# EAGLE design keyboard_project (EAGLE 7.1.0)
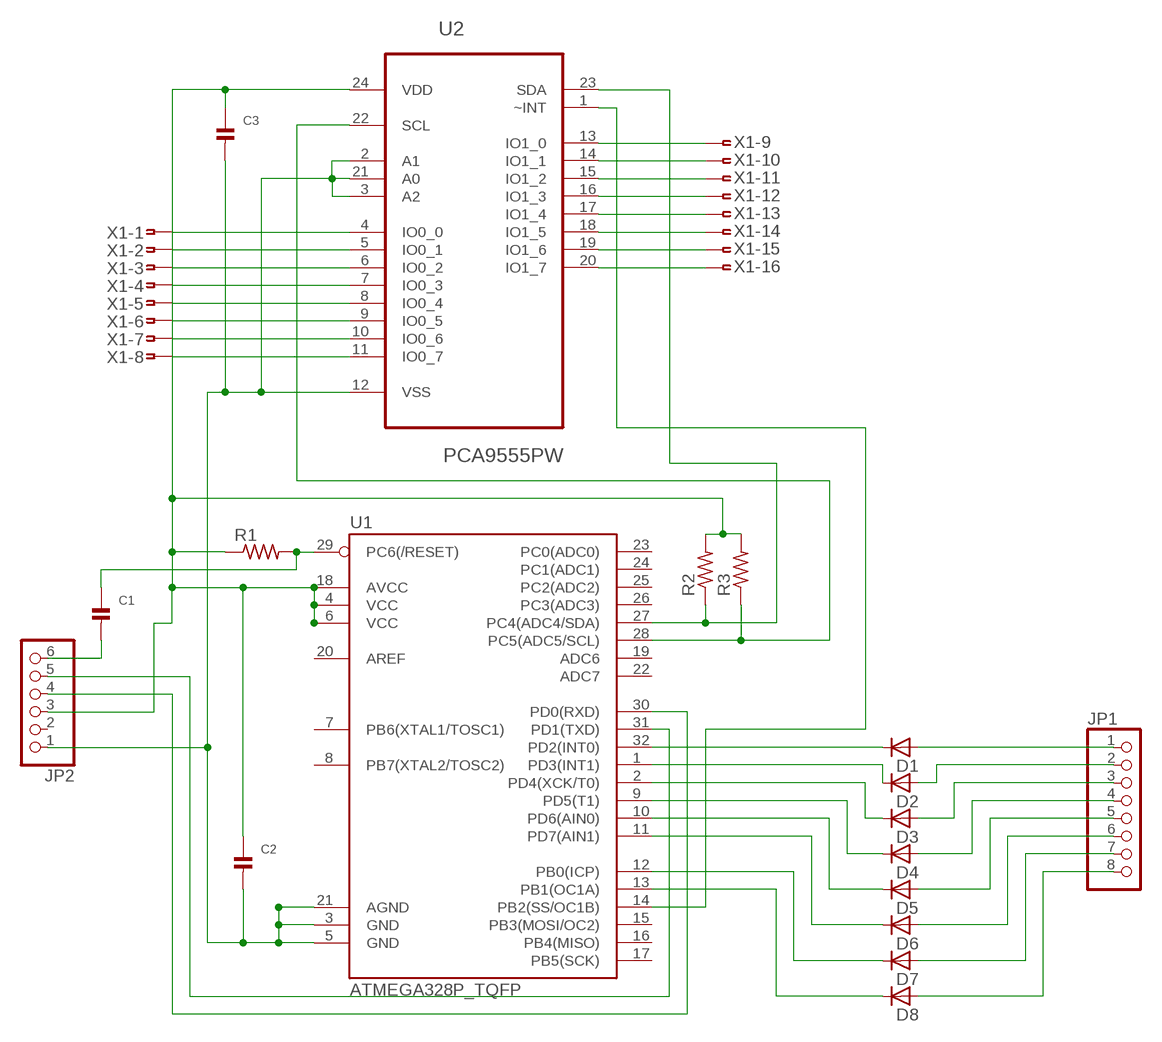
[diagram p0: schematic, sheet 1]

## Parts
C1  CAP_CERAMIC0603  [0603]
C2  CAP_CERAMIC0603  [0603]
C3  CAP_CERAMIC0603  [0603]
D1  D1N4148  [D45/2]
D2  D1N4148  [D45/2]
D3  D1N4148  [D45/2]
D4  D1N4148  [D45/2]
D5  D1N4148  [D45/2]
D6  D1N4148  [D45/2]
D7  D1N4148  [D45/2]
D8  D1N4148  [D45/2]
JP1  PINHD-1X8  [1X08]
JP2  HEADER-1X6  [1X06_OVAL]
R1  R-US_R0603  [R0603]
R2  R-US_R0603  [R0603]
R3  R-US_R0603  [R0603]
U1  ATMEGA328P_TQFP  [TQFP32-08]
U2  PCA9555PW  [SOP65P640X110-24N]
X1  FTOP-16  [FTOP-16]

## Nets
N$1: U2.4(IO0_0) X1.1
N$2: U2.5(IO0_1) X1.2
N$3: U2.6(IO0_2) X1.3
N$4: U2.7(IO0_3) X1.4
N$5: U2.8(IO0_4) X1.5
N$6: U2.9(IO0_5) X1.6
N$7: U2.10(IO0_6) X1.7
N$8: U2.11(IO0_7) X1.8
N$9: U2.13(IO1_0) X1.9
N$10: U2.14(IO1_1) X1.10
N$11: U2.15(IO1_2) X1.11
N$12: U2.16(IO1_3) X1.12
N$13: U2.17(IO1_4) X1.13
N$14: U2.18(IO1_5) X1.14
N$15: U2.19(IO1_6) X1.15
N$16: U2.20(IO1_7) X1.16
N$17: D1.A JP1.1
N$18: D2.A JP1.2
N$19: D3.A JP1.3
N$20: D4.A JP1.4
N$21: D5.A JP1.5
N$22: D6.A JP1.6
N$23: D7.A JP1.7
N$24: D8.A JP1.8
N$25: D1.C U1.32(PD2(INT0))
N$26: D2.C U1.1(PD3(INT1))
N$27: D3.C U1.2(PD4(XCK/T0))
N$28: D4.C U1.9(PD5(T1))
N$29: D5.C U1.10(PD6(AIN0))
N$30: D6.C U1.11(PD7(AIN1))
N$31: D7.C U1.12(PB0(ICP))
N$32: D8.C U1.13(PB1(OC1A))
N$33: R3.1 U1.28(PC5(ADC5/SCL)) U2.22(SCL)
N$34: R2.1 U1.27(PC4(ADC4/SDA)) U2.23(SDA)
N$36: C2.2 C3.2 JP2.1 U1.3(GND) U1.5(GND) U1.21(AGND) U2.2(A1) U2.3(A2) U2.12(VSS) U2.21(A0)
N$37: C2.1 C3.1 JP2.3 R1.1 R2.2 R3.2 U1.4(VCC) U1.6(VCC) U1.18(AVCC) U2.24(VDD)
N$39: C1.1 R1.2 U1.29(PC6(/RESET))
N$41: C1.2 JP2.6
N$42: JP2.5 U1.31(PD1(TXD))
N$43: JP2.4 U1.30(PD0(RXD))
N$45: U1.14(PB2(SS/OC1B)) U2.1(~INT)
Unconnected: JP2.2 U1.7(PB6(XTAL1/TOSC1)) U1.8(PB7(XTAL2/TOSC2)) U1.15(PB3(MOSI/OC2)) U1.16(PB4(MISO)) U1.17(PB5(SCK)) U1.19(ADC6) U1.20(AREF) U1.22(ADC7) U1.23(PC0(ADC0)) U1.24(PC1(ADC1)) U1.25(PC2(ADC2)) U1.26(PC3(ADC3))

## Library data of the parts
C1-C3 = OLED_mod:CAP_CERAMIC: Ceramic Capacitors 0402 - 0402 Surface Mount Capacitors 16pF 50V 5% [Digikey: 445-4899-2-ND] 18pF 50V 5% [Digikey: 490-1281-2-ND] 22pF 50V 5% [Digikey: 490-1283-2-ND] 68pF 50V 5% [Digikey: 490-1289-2-ND] 0.1uF 10V 10% [Digikey: 490-1318-2-ND] 1.0uF 6.3V 10% [Digikey: 490-1320-2-ND] 0603 - 0603 Surface Mount Capacitors 16 pF 50V 5% [Digikey: 445-5051-2-ND] 22 pF 50V [Digikey: PCC220ACVTR-ND] 33 pF 50V 5% [Digikey: 490-1415-1-ND] 56pF 50V 5% [Digikey: 490-1421-1-ND] 220pF 50V 5% [Digikey: 445-1285-1-ND] 680 pF 50V 2200 pF 50V 5% C0G [Digikey: 445-1297-1-ND] 5600 pF 100V 5% X7R [Digikey: 478-3711-1-ND] 0.1 µF 25V 10% [Digikey: PCC2277TR-ND] 0.22 µF 16V 10% X7R [Digikey: 445-1318-1-ND] 1.0 µF 25V 10% [Digikey: 445-5146-2-ND] 0603 - RF Specific 3pF 250V +/-0.1pF RF [Digikey: 712-1347-1-ND] 18 pF 250V 5% [Digikey: 478-3505-1-ND or 712-1322-1-ND] 56 pF 250V 5% C0G RF [Digikey: 490-4867-1-ND] 68 pF 250V RF [Digikey: 490-4868-1-ND] 0805 - 0805 Surface Mount Capacitors 220 pF 250V 2% RF Ceramic Capacitor [Digikey: 712-1398-1-ND] 1000 pF 50V 2% NP0 Ceramic Capacitor [Digikey: 478-3760-1-ND] 0.1 µF 25V 10% Ceramic Capacitor [Digikey: PCC1828TR-ND] 1.0 µF 16V 10% Ceramic Capacitor[Digikey: 490-1691-2-ND] 10.0 µF 10V 10% Ceramic Capacitor[Digikey: 709-1228-1-ND] 10.0 uF 16V 10% Ceramic Capacitor [Digikey: 478-5165-2-ND] 47 uF 6.3V 20% Ceramic Capacitor [Digikey: 587-1779-1-ND or 399-5506-1-ND] 1206 - 1206 Surface Mount Capacitors 47uF 10V 20% Ceramic Capacitor [Digikey: 490-5528-1-ND or 399-5508-1-ND or 445-6010-1-ND] 100uF 6.3V -20%, +80% Y5V Ceramic Capacitor (Digikey: 490-4512-1-ND, Mouser: 81-GRM31CF50J107ZE1L)
D1-D8 = candrian:D
JP1 = pinhead:PINHD-1X8: PIN HEADER
JP2 = OLED_mod:HEADER-1X6: PIN HEADER
R1-R3 = rcl:R-US_: RESISTOR, American symbol
U1 = SparkFun-DigitalIC:ATMEGA328P_TQFP; PROD_ID: IC-09069
U2 = NXP_By_element14_Batch_1:PCA9555PW: 16-bit I2C-bus and SMBus I/O port with interrupt; MPN: PCA9555PW; OC_FARNELL: -; OC_NEWARK: 11N8512; PACKAGE: TSSOP-24; SUPPLIER: NXP
X1 = con-amp:FTOP-16: AMP connector

## Board
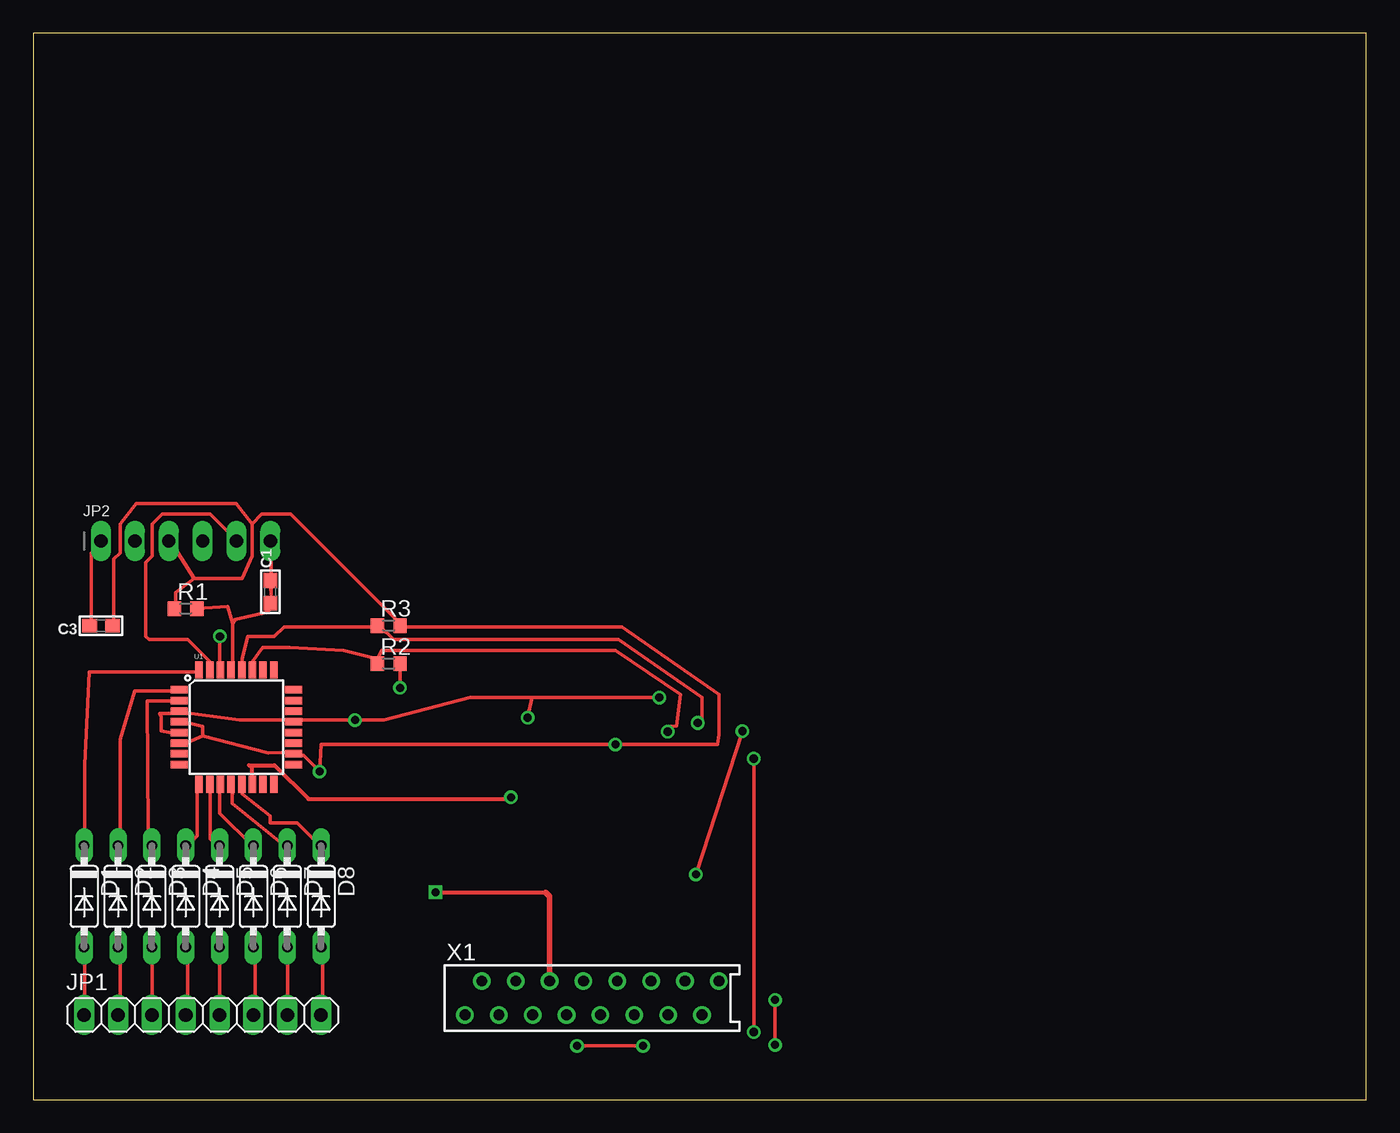
[diagram p1: board, top side]
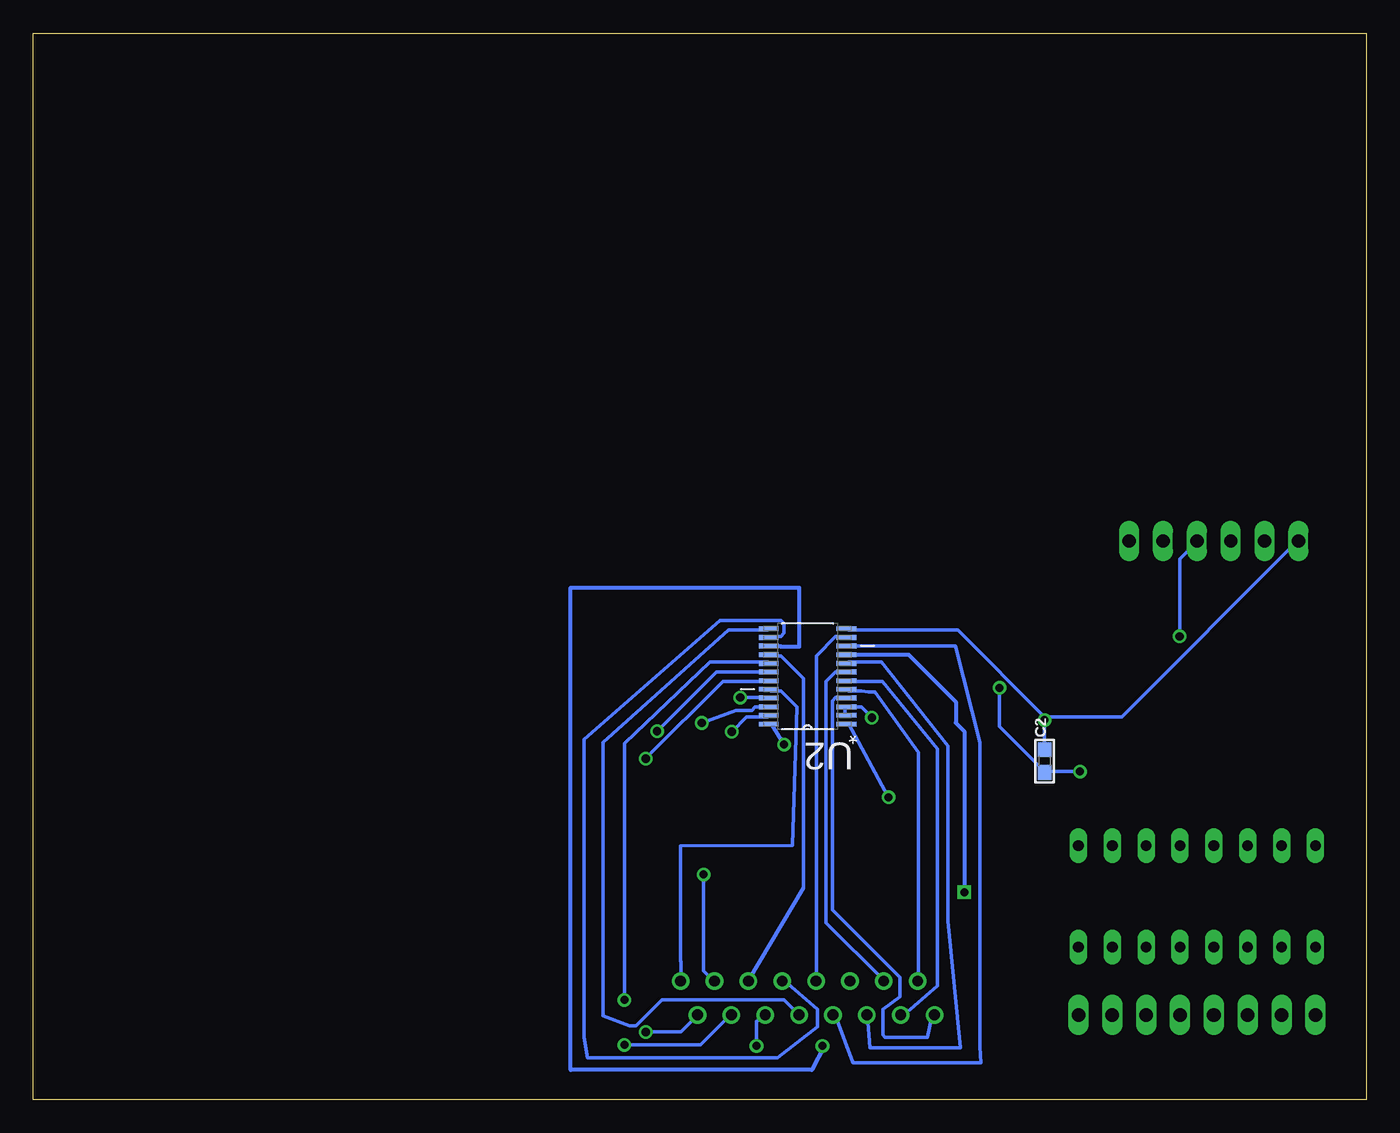
[diagram p2: board, bottom side, seen from below]

Size 100 x 80 mm. Coordinates in mm from the lower left corner, seen from the top.
Outline: 0,0 100,0 100,80 0,80 0,0
Copper layers (1*16): Top 0.035mm / dielectric 1.5mm / Bottom 0.035mm
Design rules "default *": minimum track width 10mil, minimum drill 24mil, track to track 9mil, track to pad 8mil, pad to pad 8mil, via to via 8mil, smd to smd 8mil, copper to edge 40mil, drill to drill 8mil, minimum pad ring 10mil, minimum via ring 8mil, stop-mask expansion 4mil, vias tented up to drill 0mil, thermal gap 10mil
tRestrict: area 30.5,5.1 to 53.3,10.2
vRestrict: area 11.4,24.1 to 19.1,31.8; area 39.4,27.9 to 44.5,36.8

### Footprints (pad centres in the part's own frame; a part is rotated, then mirrored left to right if it is on the bottom)
0603 = smd 1.1 x 1: 1 -0.85,0; 2 0.85,0
D45/2 = drill 0.8 long: A 3.81,0; C -3.81,0
1X08 = drill 1.016 long: 1 -8.89,0; 2 -6.35,0; 3 -3.81,0; 4 -1.27,0; 5 1.27,0; 6 3.81,0; 7 6.35,0; 8 8.89,0
1X06_OVAL = drill 1 long: 1 -6.35,0; 2 -3.81,0; 3 -1.27,0; 4 1.27,0; 5 3.81,0; 6 6.35,0
R0603 = smd 1 x 1.1: 1 -0.85,0; 2 0.85,0
TQFP32-08 = smd 1.27 x 0.559: 1 -4.293,2.8; 2 -4.293,2; 3 -4.293,1.2; 4 -4.293,0.4; 5 -4.293,-0.4; 6 -4.293,-1.2; 7 -4.293,-2; 8 -4.293,-2.8; 17 4.293,-2.8; 18 4.293,-2; 19 4.293,-1.2; 20 4.293,-0.4; 21 4.293,0.4; 22 4.293,1.2; 23 4.293,2; 24 4.293,2.8 | smd 0.559 x 1.27: 9 -2.8,-4.293; 10 -2,-4.293; 11 -1.2,-4.293; 12 -0.4,-4.293; 13 0.4,-4.293; 14 1.2,-4.293; 15 2,-4.293; 16 2.8,-4.293; 25 2.8,4.293; 26 2,4.293; 27 1.2,4.293; 28 0.4,4.293; 29 -0.4,4.293; 30 -1.2,4.293; 31 -2,4.293; 32 -2.8,4.293
SOP65P640X110-24N = smd 1.473 x 0.356: 1 -2.921,3.581; 2 -2.921,2.921; 3 -2.921,2.286; 4 -2.921,1.626; 5 -2.921,0.965; 6 -2.921,0.33; 7 -2.921,-0.33; 8 -2.921,-0.965; 9 -2.921,-1.626; 10 -2.921,-2.286; 11 -2.921,-2.921; 12 -2.921,-3.581; 13 2.921,-3.581; 14 2.921,-2.921; 15 2.921,-2.286; 16 2.921,-1.626; 17 2.921,-0.965; 18 2.921,-0.33; 19 2.921,0.33; 20 2.921,0.965; 21 2.921,1.626; 22 2.921,2.286; 23 2.921,2.921; 24 2.921,3.581
FTOP-16 = drill 0.813: 1 -9.525,-1.27; 2 -8.255,1.27; 3 -6.985,-1.27; 4 -5.715,1.27; 5 -4.445,-1.27; 6 -3.175,1.27; 7 -1.905,-1.27; 8 -0.635,1.27; 9 0.635,-1.27; 10 1.905,1.27; 11 3.175,-1.27; 12 4.445,1.27; 13 5.715,-1.27; 14 6.985,1.27; 15 8.255,-1.27; 16 9.525,1.27

### Placement (x,y rotation side)
C1  17.78,38.1 90 top
C2  24.13,25.4 90 bottom
C3  5.08,35.56 180 top
D1  3.81,15.24 270 top
D2  6.35,15.24 270 top
D3  8.89,15.24 270 top
D4  11.43,15.24 270 top
D5  13.97,15.24 270 top
D6  16.51,15.24 270 top
D7  19.05,15.24 270 top
D8  21.59,15.24 270 top
JP1  12.7,6.35 0 top
JP2  11.43,41.91 0 top
R1  11.43,36.83 0 top
R2  26.67,32.7 0 top
R3  26.67,35.56 0 top
U1  15.24,27.94 0 top
U2  41.91,31.75 180 bottom
X1  41.91,7.62 0 top

### Tracks (layer width: path | path; a pad name or v marks a point on that pad's centre or on a via)
N$1
  Bottom 0.254: U2.4 39.09,30.16 39.81,30.16 40.06,29.92 40.06,14.24 34.99,9.17 34.99,7.72 36.27,6.76 36.27,4.84 36.11,4.67 32.91,4.67 32.58,6.27 X1.1
N$2
  Bottom 0.254: U2.5 38.85,30.64 37.88,30.64 37.33,30.57 36.84,30.57 33.6,26.06 33.6,10.13 33.54,8.93 X1.2
N$3
  Bottom 0.254: U2.6 38.85,31.37 36.28,31.37 32.17,26.3 32.17,8.53 34.75,6.27 X1.3
N$4
  Bottom 0.254: U2.7 39.09,32.09 39.81,32.09 40.54,31.37 40.54,13.27 36.2,8.93 X1.4
N$5
  Bottom 0.254: U2.8 38.85,32.82 36.37,32.82 31.37,26.54 31.37,13.41 30.43,3.87 37.22,3.87 37.4,6.27 X1.5
N$6  (via drill 0.6)
  Top 0.305: v30.16,15.56 38.42,15.56
  Top 0.406: X1.6 38.73,15.24 38.42,15.56
  Bottom 0.305: U2.9 34.33,33.38 30.8,29.84 30.8,28.26 30.16,27.62 v30.16,15.56
N$7
  Bottom 0.254: U2.10 38.85,34.02 30.82,34.02 28.98,26.78 28.98,3.96 28.92,2.76 38.52,2.76 39.81,6.27 X1.7
N$8
  Bottom 0.254: U2.11 39.09,34.75 39.81,34.75 41.26,33.3 41.26,8.93 X1.8
N$9
  Bottom 0.254: X1.9 43.67,7.48 52.84,7.48 54.77,5.55 55.26,5.55 57.25,6.27 57.25,26.78 47.85,35.23 44.88,35.23 U2.13
N$10
  Bottom 0.254: U2.14 44.64,34.75 43.92,34.75 43.67,34.99 43.67,35.71 43.92,35.95 48.49,35.95 58.69,27.03 58.69,4.66 58.43,3.14 44.16,3.14 41.19,5.47 41.19,6.76 43.67,8.93 X1.10
N$11  (via drill 0.61)
  Top 0.254: v45.74,4.03 v40.79,4.03
  Bottom 0.254: 43.92,34.02 44.64,34.02 U2.15 | v45.74,4.03 45.74,5.87 44.88,6.27 X1.11
  Bottom 0.305: v40.79,4.03 40.64,4.03 41.59,2.22 59.69,2.22 59.69,38.42 42.55,38.42 42.55,33.97 43.92,33.97 43.92,34.02
N$12
  Bottom 0.254: U2.16 44.64,33.3 43.92,33.3 42.23,31.61 42.23,15.89 46.33,8.93 X1.12
N$13  (via drill 0.61)
  Top 0.254: v55.65,4.1 v55.65,7.47
  Bottom 0.254: v55.65,7.47 55.65,26.71 49.23,32.82 44.88,32.82 U2.17 | v55.65,4.1 49.95,4.1 47.78,6.27 X1.13
N$14  (via drill 0.61)
  Top 0.254: v49.71,16.89 v53.2,27.64
  Bottom 0.254: v53.2,27.64 48.74,32.09 44.88,32.09 U2.18 | v49.71,16.89 49.71,9.65 48.98,8.93 X1.14
N$15  (via drill 0.61)
  Top 0.254: v54.05,5.07 v54.05,25.58
  Bottom 0.254: v54.05,25.58 48.26,31.37 44.88,31.37 U2.19 | v54.05,5.07 51.4,5.07 50.19,6.27 X1.15
N$16
  Bottom 0.254: U2.20 44.64,30.64 43.92,30.64 42.71,29.44 43.03,19.06 51.44,19.05 51.44,10.38 51.4,10.38 51.4,8.93 X1.16
N$17
  Top 0.254: D1.A 3.86,11.34 3.86,6.51 JP1.1
N$18
  Top 0.254: D2.A 6.51,11.34 6.51,6.51 JP1.2
N$19
  Top 0.254: D3.A 8.93,11.34 8.93,6.51 JP1.3
N$20
  Top 0.254: D4.A 11.58,11.34 11.58,6.51 JP1.4
N$21
  Top 0.254: D5.A 13.99,11.34 13.99,6.51 JP1.5
N$22
  Top 0.254: D6.A 16.65,11.34 16.65,6.51 JP1.6
N$23
  Top 0.254: D7.A 19.06,11.34 19.06,6.51 JP1.7
N$24
  Top 0.254: D8.A 21.72,11.34 21.72,6.51 JP1.8
N$25
  Top 0.254: U1.32 12.31,32.09 4.19,32.09 3.86,25.09 3.86,19.06 D1.C
N$26
  Top 0.254: U1.1 10.86,30.64 7.59,30.64 6.51,27.03 6.51,19.06 D2.C
N$27
  Top 0.254: U1.2 10.86,29.92 8.55,29.92 8.61,20.14 8.93,19.06 D3.C
N$28
  Top 0.254: U1.9 12.31,23.65 12.31,19.79 11.58,19.06 D4.C
N$29
  Top 0.254: U1.10 13.27,23.65 13.27,19.55 13.75,19.06 D5.C
N$30
  Top 0.254: U1.11 13.99,23.65 13.99,21.48 16.41,19.06 D6.C
N$31
  Top 0.254: U1.12 14.96,23.65 14.96,22.92 14.92,22.92 14.92,22.23 18.82,19.06 D7.C
N$32
  Top 0.254: U1.13 15.68,23.65 15.68,22.92 17.78,21.27 17.78,20.75 19.79,20.75 21.48,19.06 D8.C
N$33  (via drill 0.61)
  Top 0.254: U1.28 15.68,32.33 15.68,33.06 16.09,34.73 18.09,34.73 18.82,35.47 25.82,35.47 R3.1 26.06,35.47 27.03,34.51 43.92,34.51 50.16,30.16 50.16,28.57 v49.85,28.26
  Bottom 0.254: v49.85,28.26 47.3,29.2 46.09,29.2 45.85,29.44 44.88,29.44 U2.22
N$34  (via drill 0.61)
  Top 0.254: 25.82,33.06 23.27,33.69 19.21,33.93 17.21,33.93 16.41,32.82 16.41,32.33 U1.27 | v47.6,27.6 47.6,28 48.25,28.02 48.56,30.4 43.67,33.71 26.15,33.71 25.82,33.06 | 25.82,33.06 R2.1
  Bottom 0.254: v47.6,27.6 46.48,28.71 44.88,28.71 U2.23
N$36  (via drill 0.61)
  Top 0.254: U1.5 10.86,27.51 10.38,27.51 9.58,27.67 9.58,28.71 9.5,28.96 10.86,28.96 U1.3 11.1,28.96 11.82,28.96 15.48,28.47 19.3,28.47 U1.21 19.55,28.47 v24.13,28.47 26.3,28.47 32.75,30.16 37.4,30.16 | 37.4,30.16 v46.97,30.16 | 37.4,30.16 v37.08,28.65 | C3.2 4.34,35.71 4.34,41.02 5.07,41.74 JP2.1
  Bottom 0.254: U2.2 39.09,28.96 39.09,29.44 U2.3 38.85,29.44 37.88,29.44 v37.08,28.65 | v46.97,30.16 44.88,30.16 U2.21 | 24.13,28.71 v24.13,28.47 C2.2 | 24.13,28.71 30.64,35.23 38.85,35.23 U2.12 | 24.13,28.71 18.34,28.71 5.31,41.74 JP2.1
N$37  (via drill 0.61)
  Top 0.254: 16.41,43.19 15.2,44.72 7.72,44.72 6.51,43.19 6.51,41.02 6.03,40.54 6.03,35.71 C3.1 | 16.41,43.19 16.41,40.78 15.68,39.1 12.06,39.1 | 12.06,39.1 10.38,41.74 JP2.3 | 12.06,39.1 10.68,38.04 10.68,36.66 R1.1 | 16.41,43.19 17.13,43.92 19.3,43.92 27.51,35.71 R3.2 27.75,35.47 44.16,35.47 51.45,30.4 51.45,27.38 51.33,26.63 v43.67,26.63 21.59,26.63 v21.48,24.61 20.27,25.82 19.55,25.82 U1.18 19.3,26.06 18.82,26.06 17.61,26 12.7,27.27 | 12.7,27.27 11.58,26.78 11.1,26.78 U1.6 | 12.7,27.27 12.7,27.99 11.82,28.23 11.1,28.23 U1.4 | v27.51,30.89 27.51,32.82 R2.2
  Bottom 0.254: v21.48,24.61 24.13,24.61 | v27.51,30.89 27.51,27.99 24.13,24.61 | 24.13,24.61 C2.1 | v43.67,26.63 44.64,28.23 U2.24
N$39
  Top 0.254: 14.96,35.71 15.15,36.03 17.61,36.59 C1.1 | 14.96,35.71 14.59,36.98 R1.2 | 14.96,35.71 14.96,32.33 U1.29
N$41
  Top 0.254: C1.2 17.86,37.88 17.86,41.74 JP2.6
N$42
  Top 0.254: U1.31 13.27,32.33 13.27,32.82 11.58,34.51 8.69,34.51 8.45,34.75 8.45,40.3 8.93,40.78 8.93,43.19 9.65,43.92 13.27,43.92 15.2,41.99 JP2.5
N$43  (via drill 0.61)
  Top 0.254: v13.99,34.75 13.99,32.33 U1.30
  Bottom 0.254: v13.99,34.75 13.99,40.54 12.79,41.74 JP2.4
N$45  (via drill 0.61)
  Top 0.254: 16.41,23.65 U1.14
  Top 0.305: 16.41,23.65 16.41,24.87 16.19,25.08 18.1,25.08 20.64,22.54 35.7,22.54 v35.84,22.68
  Bottom 0.254: v35.84,22.68 38.85,28.23 U2.1